# EasyEDA schematic RocketBoard.json
TITLE: Sheet_1; REV: 1.0; Date: 2024-11-21; Sheet: 1/1; Drawn By: suturin_daniil; Company: Your Company
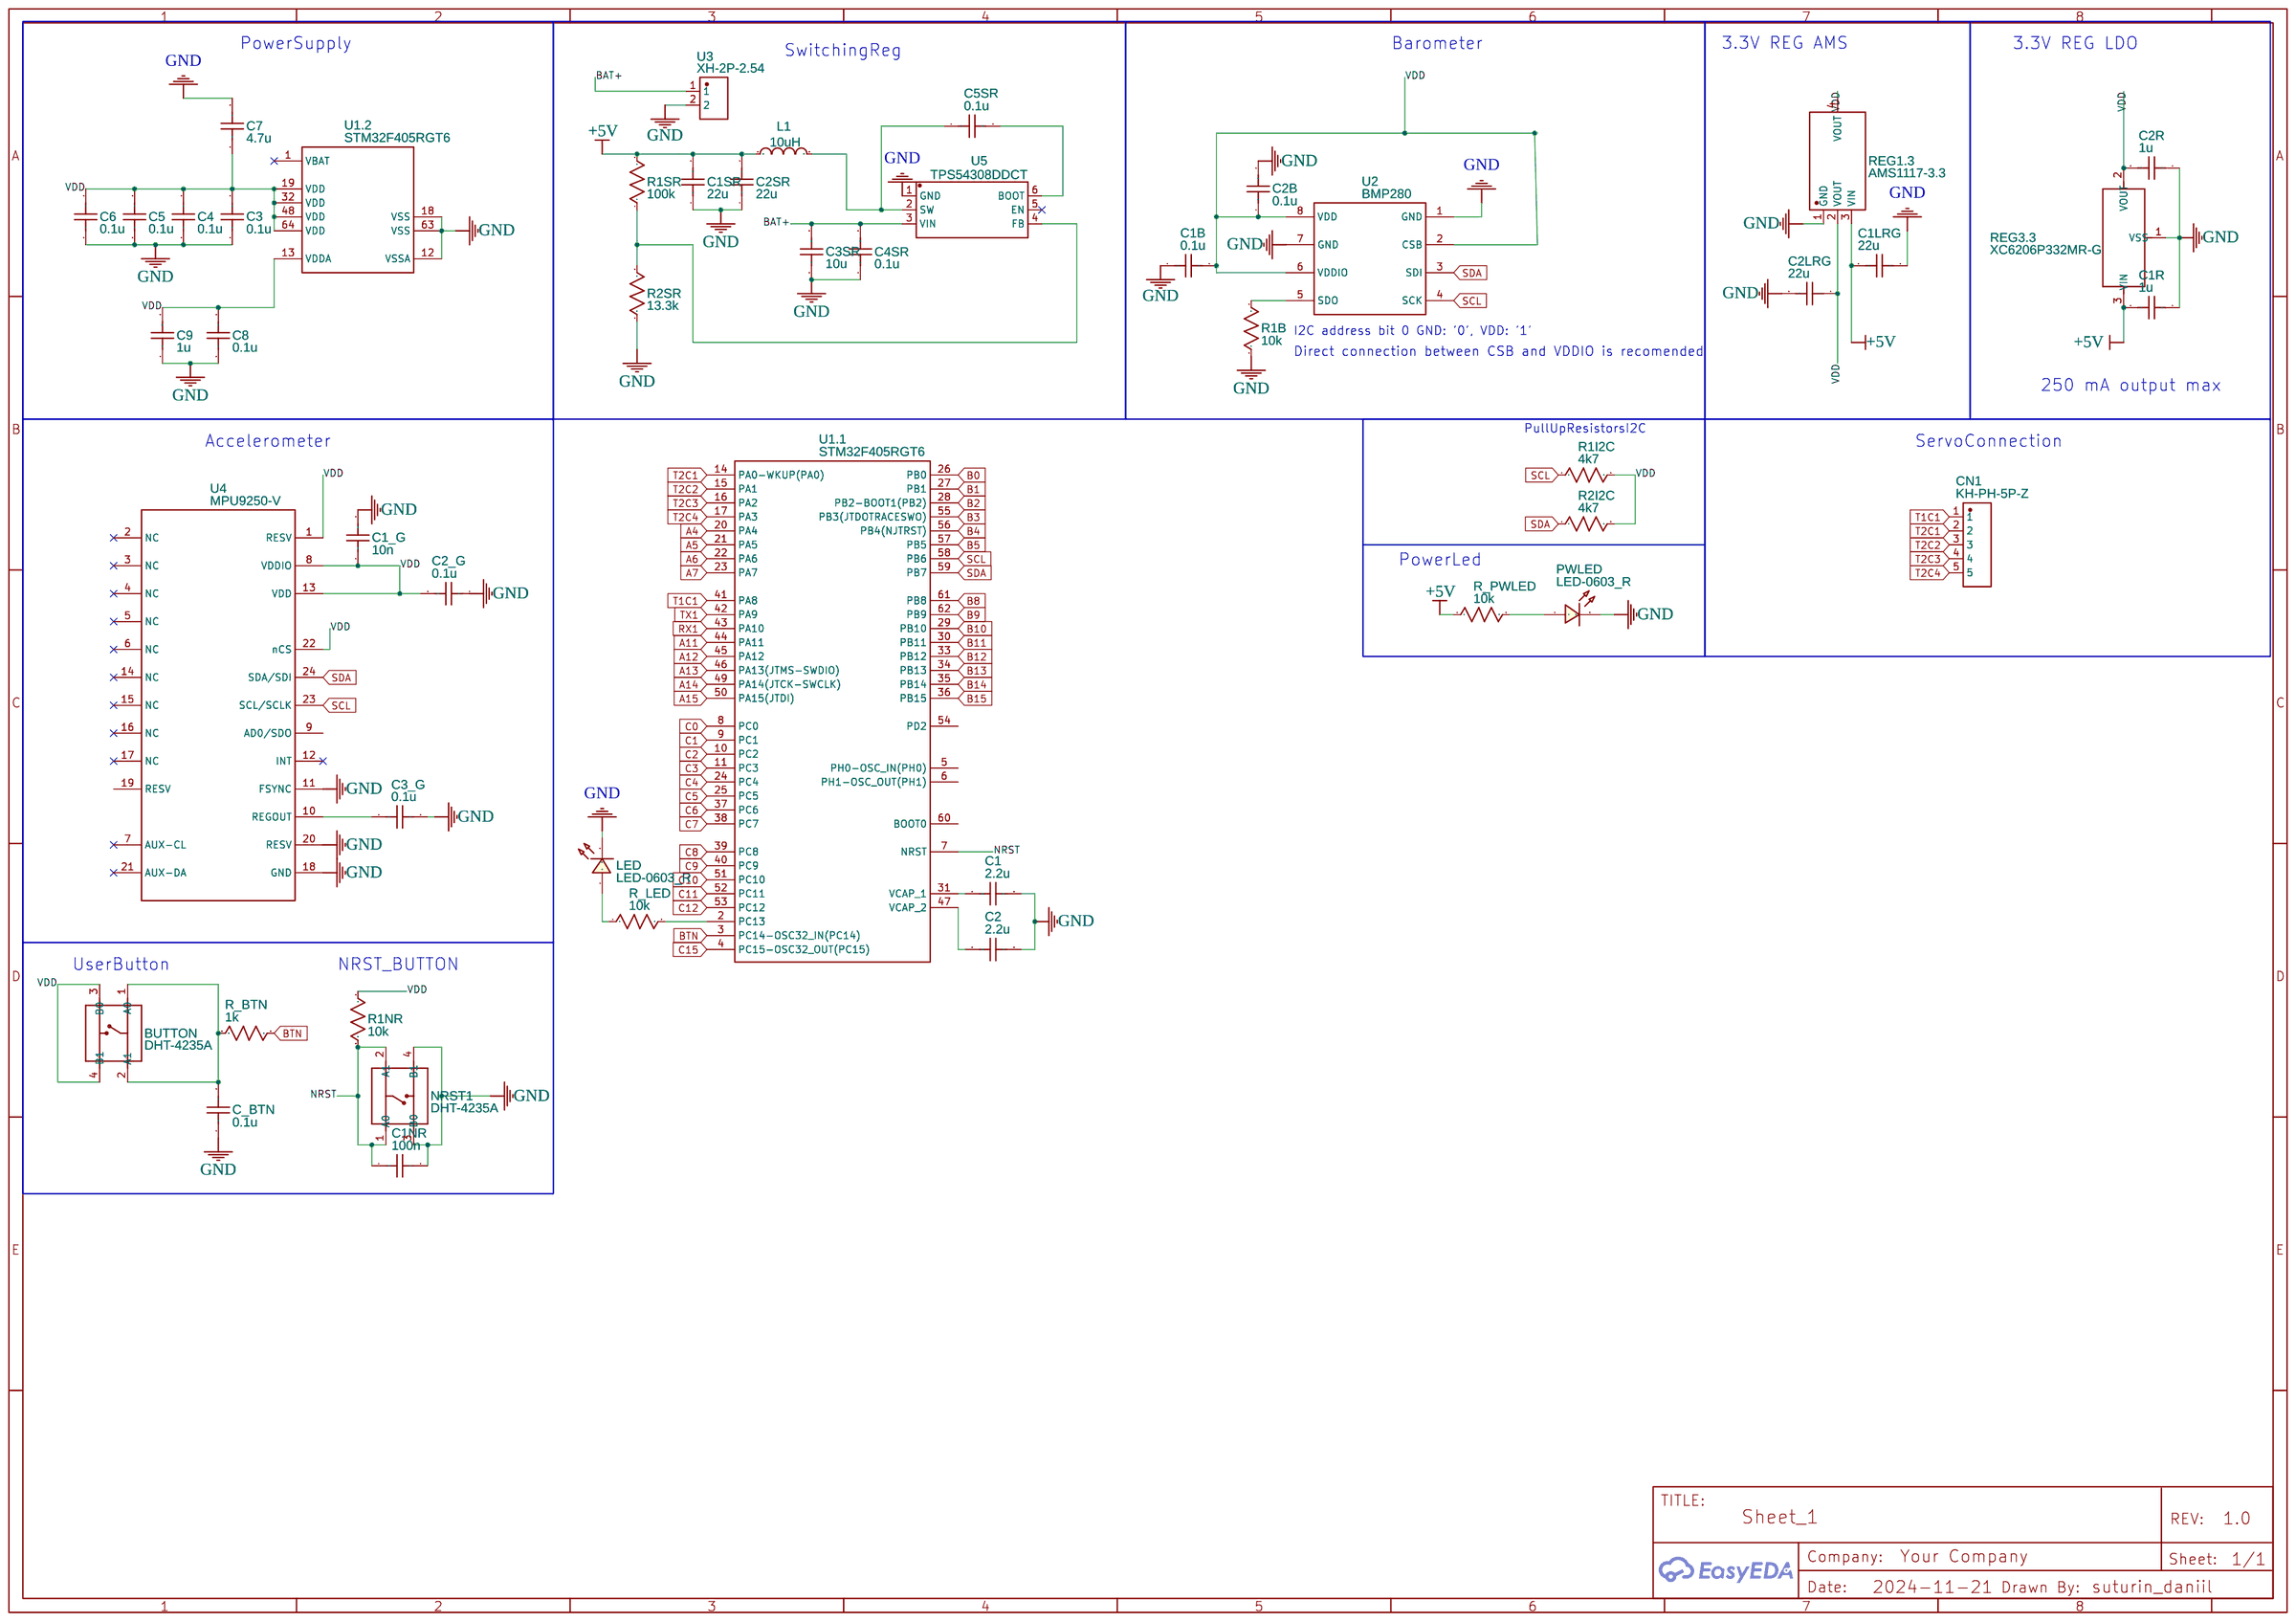
[diagram p0: schematic sheet]

## Parts
BUTTON  DHT-4235A  [SW4-SMD-4.2X3.2X2.5MM]
C1  2.2u  [C0603]
C1_G  10n  [C0603]
C1B  0.1u  [C0603]
C1LRG  22u  [C0805]
C1NR  100n  [C0603]
C1R  1u  [C0603]
C1SR  22u  [C0805]
C2  2.2u  [C0603]
C2_G  0.1u  [C0603]
C2B  0.1u  [C0603]
C2LRG  22u  [C0805]
C2R  1u  [C0603]
C2SR  22u  [C0805]
C3  0.1u  [C0603]
C3_G  0.1u  [C0603]
C3SR  10u  [C0805]
C4  0.1u  [C0603]
C4SR  0.1u  [C0805]
C5  0.1u  [C0603]
C5SR  0.1u  [C0805]
C6  0.1u  [C0603]
C7  4.7u  [C0603]
C8  0.1u  [C0603]
C9  1u  [C0603]
C_BTN  0.1u  [C0603]
CN1  KH-PH-5P-Z  [CONN-TH_5P-P2.00_KINGHELM_KH-PH-5P-Z]
L1  10uH  [L1210]
LED  LED-0603_R  [LED0603_RED]
NRST1  DHT-4235A  [SW4-SMD-4.2X3.2X2.5MM]
PWLED  LED-0603_R  [LED0603_RED]
R1B  10k  [R0603]
R1I2C  4k7  [R0603]
R1NR  10k  [R0603]
R1SR  100k  [R0603]
R2I2C  4k7  [R0603]
R2SR  13.3k  [R0603]
R_BTN  1k  [R0603]
R_LED  10k  [R0603]
R_PWLED  10k  [R0603]
REG1  AMS1117-3.3  [SOT-223-3_L6.5-W3.4-P2.30-LS7.0-BR]  (section 3)
REG3  XC6206P332MR-G  [SEEED-SOT-23]  (section 3)
U1  STM32F405RGT6  [LQFP-64_L10.0-W10.0-P0.50-LS12.0-BL]  (sections 1,2)
U2  BMP280  [LGA-8_L2.5-W2.0-P0.65_AMP6127]
U3  XH-2P-2.54  [CONN-TH_2P-P2.50-XH2.54-2P]
U4  MPU9250-V  [MPU9250]
U5  TPS54308DDCT  [TSOT-23-6_L2.9-W1.6-P0.95-LS2.8-BR]

## Library data of the parts
BUTTON NRST1 = -: SMD Button Top
C1 C1_G C1R C1SR C2 C2_G C2R C2SR C3 C3_G C3SR C4 C4SR C5 C5SR C6-C9 C_BTN = C_0603_US: Contributor: LCEDA_Lib
C1B C1LRG C1NR C2B C2LRG = C_0805_US: Contributor: LCEDA_Lib
CN1 = KH-PH-5P-Z: Contributor: LCSC; Supplier: LCSC; Supplier Part: C2898948; Manufacturer: kinghelm(金航标); JLCPCB Part Class: Extended Part
L1 = L0603_US: Contributor: LCEDA_Lib
LED PWLED = LED-0603_R: Manufacturer: EVERLIGHT(台湾亿光); Manufacturer Part: 19-217/R6C-AL1M2VY/3T; Supplier Part: C72044; Supplier: LCSC; Contributor: LCEDA_01
R1B R1I2C R1SR R2I2C R2SR R_BTN R_LED R_PWLED = R_0603_US: Contributor: LCEDA_Lib
R1NR = R_0402_US: Contributor: LCEDA_Lib
REG1 = AMS1117-3.3: sourceId: dwIGgezVh; Supplier: LCSC; Manufacturer: AMS; Supplier Part: C6186; JLCPCB Part Class: Basic Part
REG3 = XC6206P332MR-G: SMD PMIC;LDO;Vin 6V;3.3V;200mA;Without En;1-Ch; sourceId: sIGDBzxv5
U1 = STM32F405RGT6: tags: STM32; subpart_no: 1; image: http://image.lceda.cn/szlcsc/C15742.jpg; Supplier Part: C15742; Supplier: LCSC; Manufacturer: ST(意法半导体); JLCPCB Part Class: Extended Part
U2 = BMP280: Supplier: LCSC; Manufacturer: Bosch(博世); Supplier Part: C83291; JLCPCB Part Class: Extended Part
U3 = XH-2P-2.54: Contributor: LCSC; Convert to PCB: Yes; Add into BOM: Yes; Supplier: LCSC; Supplier Part: C9900003929; Manufacturer: null; JLCPCB Part Class: Extended Part
U4 = MPU9250-V: Contributor: advulcan
U5 = TPS54308DDCT: Contributor: LCSC; Supplier: LCSC; Supplier Part: C2071054; Manufacturer: TI(德州仪器); JLCPCB Part Class: Extended Part

## Nets
+5V: C1LRG.2 C1R.2 C1SR.2 C2SR.2 L1.1 R1SR.2 R_PWLED.1 REG1.3(VIN) REG3.3(VIN)
GND: C1.2 C1_G.2 C1B.1 C1LRG.1 C1NR.2 C1R.1 C1SR.1 C2.2 C2_G.1 C2B.2 C2LRG.2 C2R.1 C2SR.1 C3.2 C3_G.2 C3SR.1 C4.1 C4SR.1 C5.1 C6.1 C7.2 C8.1 C9.1 C_BTN.1 LED.2 NRST1.3(B0) NRST1.4(B1) PWLED.2 R1B.1 R2SR.1 REG1.1(GND) REG3.1(VSS) U1.12(VSSA) U1.18(VSS) U1.63(VSS) U2.1(GND) U2.7(GND) U3.2 U4.11(FSYNC) U4.18(GND) U4.20(RESV) U5.1(GND)
VDD: BUTTON.3(B0) BUTTON.4(B1) C1_G.1 C1B.2 C2_G.2 C2B.1 C2LRG.1 C2R.2 C3.1 C4.2 C5.2 C6.2 C7.1 C8.2 C9.2 R1I2C.2 R1NR.1 R2I2C.2 REG1.2(VOUT) REG1.4(VOUT) REG3.2(VOUT) U1.13(VDDA) U1.19(VDD) U1.32(VDD) U1.48(VDD) U1.64(VDD) U2.2(CSB) U2.6(VDDIO) U2.8(VDD) U4.1(RESV) U4.8(VDDIO) U4.13(VDD) U4.22(nCS)
A4: U1.20(PA4)
A5: U1.21(PA5)
A6: U1.22(PA6)
A7: U1.23(PA7)
A11: U1.44(PA11)
A12: U1.45(PA12)
A13: U1.46(PA13(JTMS-SWDIO))
A14: U1.49(PA14(JTCK-SWCLK))
A15: U1.50(PA15(JTDI))
B0: U1.26(PB0)
B1: U1.27(PB1)
B2: U1.28(PB2-BOOT1(PB2))
B3: U1.55(PB3(JTDOTRACESWO))
B4: U1.56(PB4(NJTRST))
B5: U1.57(PB5)
B8: U1.61(PB8)
B9: U1.62(PB9)
B10: U1.29(PB10)
B11: U1.30(PB11)
B12: U1.33(PB12)
B13: U1.34(PB13)
B14: U1.35(PB14)
B15: U1.36(PB15)
BAT+: C3SR.2 C4SR.2 U3.1 U5.3(VIN)
BTN: R_BTN.1 U1.3(PC14-OSC32_IN(PC14))
C0: U1.8(PC0)
C1: U1.9(PC1)
C2: U1.10(PC2)
C3: U1.11(PC3)
C4: U1.24(PC4)
C5: U1.25(PC5)
C6: U1.37(PC6)
C7: U1.38(PC7)
C8: U1.39(PC8)
C9: U1.40(PC9)
C10: U1.51(PC10)
C11: U1.52(PC11)
C12: U1.53(PC12)
C15: U1.4(PC15-OSC32_OUT(PC15))
NRST: C1NR.1 NRST1.1(A0) NRST1.2(A1) R1NR.2 U1.7(NRST)
RX1: U1.43(PA10)
SCL: R1I2C.1 U1.58(PB6) U2.4(SCK) U4.23(SCL/SCLK)
SDA: R2I2C.1 U1.59(PB7) U2.3(SDI) U4.24(SDA/SDI)
T1C1: CN1.1 U1.41(PA8)
T2C1: CN1.2 U1.14(PA0-WKUP(PA0))
T2C2: CN1.3 U1.15(PA1)
T2C3: CN1.4 U1.16(PA2)
T2C4: CN1.5 U1.17(PA3)
TX1: U1.42(PA9)
Net-(BUTTON-1): BUTTON.1(A0) BUTTON.2(A1) C_BTN.2 R_BTN.2
Net-(C1-1): C1.1 U1.31(VCAP_1)
Net-(C2-1): C2.1 U1.47(VCAP_2)
Net-(C3_G-1): C3_G.1 U4.10(REGOUT)
Net-(C5SR-1): C5SR.1 L1.2 U5.2(SW)
Net-(C5SR-2): C5SR.2 U5.6(BOOT)
Net-(LED-1): LED.1 R_LED.1
Net-(PWLED-1): PWLED.1 R_PWLED.2
Net-(R1B-2): R1B.2 U2.5(SDO)
Net-(R1SR-1): R1SR.1 R2SR.2 U5.4(FB)
Net-(R_LED-2): R_LED.2 U1.2(PC13)

Not connected (* = marked no-connect by the designer): U1 1(VBAT)* 5(PH0-OSC_IN(PH0)) 6(PH1-OSC_OUT(PH1)) 54(PD2) 60(BOOT0); U4 2(NC)* 3(NC)* 4(NC)* 5(NC)* 6(NC)* 7(AUX-CL)* 9(AD0/SDO) 12(INT)* 14(NC)* 15(NC)* 16(NC)* 17(NC)* 19(RESV) 21(AUX-DA)*; U5 5(EN)*

## Notes on the sheet
- PowerSupply
- SwitchingReg
- Barometer
- 3.3V REG AMS
- 3.3V REG LDO
- I2C address bit 0 GND: '0', VDD: '1'
- Direct connection between CSB and VDDIO is recomended
- 250 mA output max
- PullUpResistorsI2C
- Accelerometer
- ServoConnection
- PowerLed
- UserButton
- NRST_BUTTON
